# EasyEDA schematic SCH_Flight-Computer-V5_2024-08-06.json

## Sheets
1 Components: TITLE: Components; REV: 1.0; Date: 2024-08-05; Sheet: 1/1; Drawn By: usedgenes; Company: Company
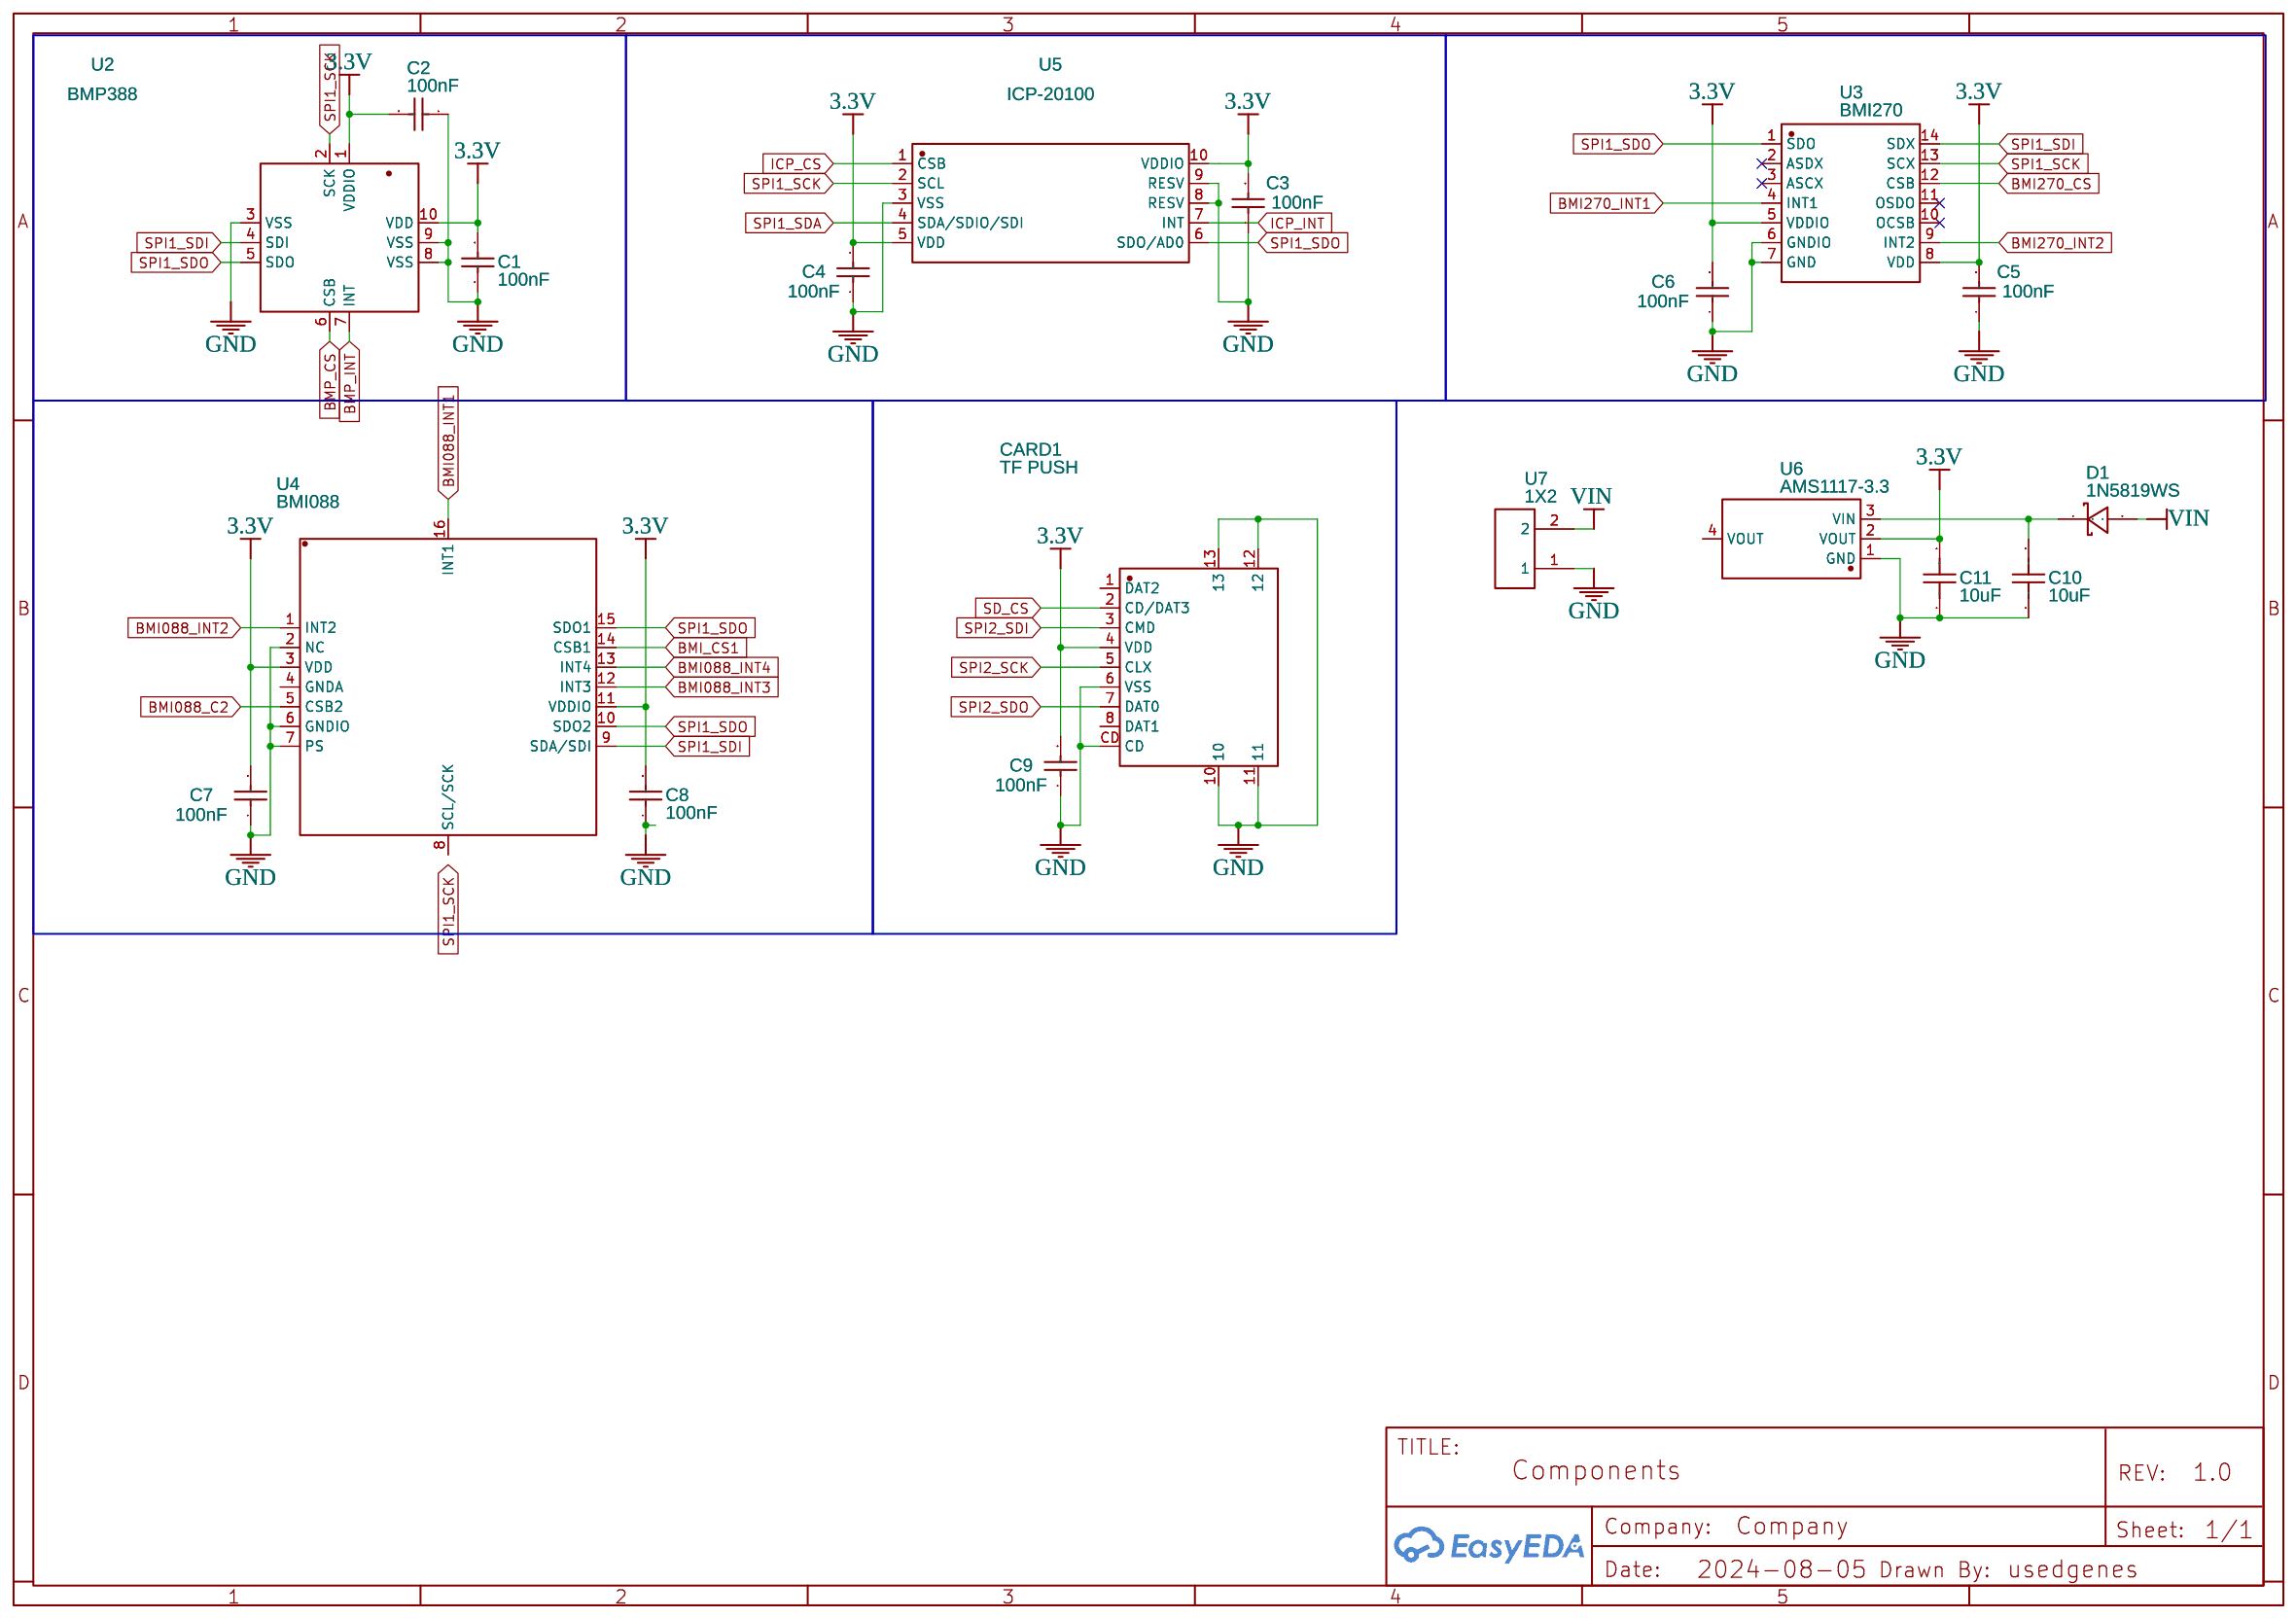
[diagram p0: Components]
2 STM: TITLE: STM Components; Company: Your Company
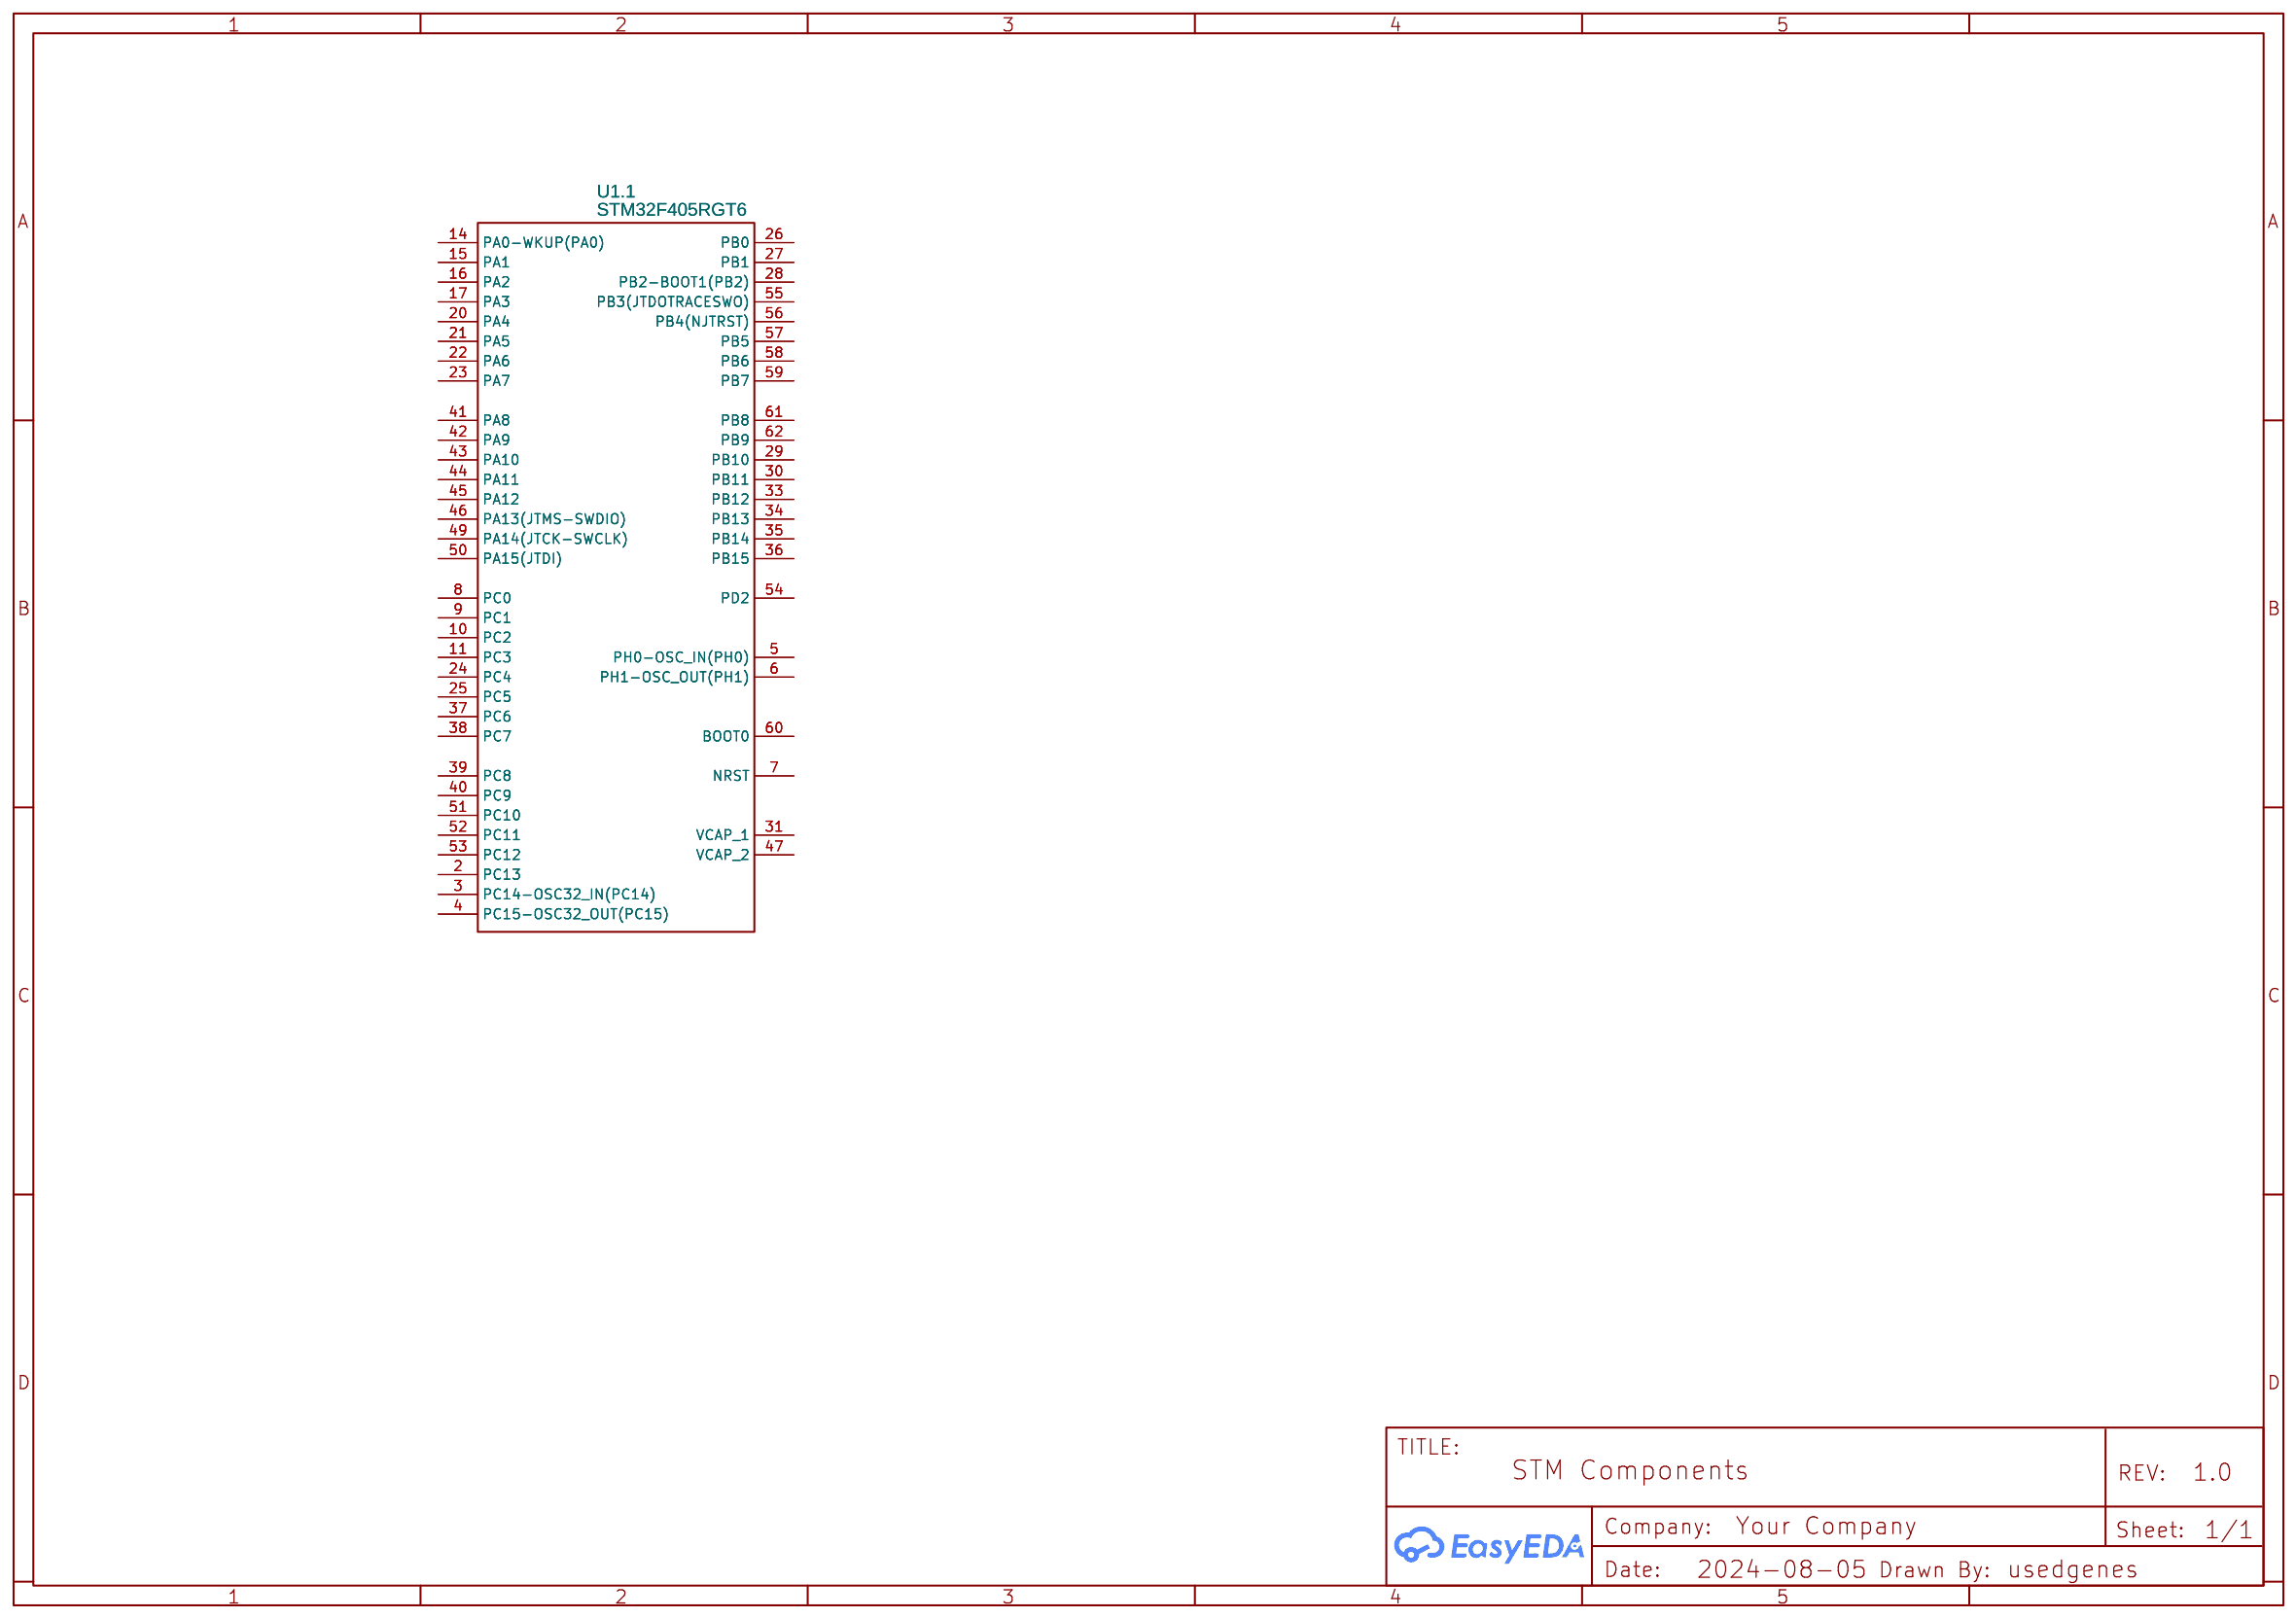
[diagram p1: STM]

## Parts
sheet Components
C1  100nF  [C0402]
C2  100nF  [C0402]
C3  100nF  [C0402]
C4  100nF  [C0402]
C5  100nF  [C0402]
C6  100nF  [C0402]
C7  100nF  [C0402]
C8  100nF  [C0402]
C9  100nF  [C0402]
C10  10uF  [C0603]
C11  10uF  [C0603]
CARD1  TF PUSH  [TF-SMD_TF-PUSH]
D1  1N5819WS  [SOD-323_L1.8-W1.3-LS2.5-RD]
U2  BMP388  [SENSORM-SMD_BMP388]
U3  BMI270  [LGA-14_L3.0-W2.5-P0.50-BR]
U4  BMI088  [LGA-16_L4.5-W3.0-P0.50-BL]
U5  ICP-20100  [LGA-10_L2.0-W2.0-P0.50-TL_ICP-20100]
U6  AMS1117-3.3  [SOT-223-3_L6.5-W3.4-P2.30-LS7.0-BR]
U7  1X2  [PIN HEADER CONNECTOR 1X2 PINS_PITCH 2.54MM]
sheet STM
U1  STM32F405RGT6  [LQFP-64_L10.0-W10.0-P0.50-LS12.0-BL]  (section 1)

## Library data of the parts
C1-C9 = CL05B104KO5NNNC: Supplier: LCSC; Manufacturer: SAMSUNG(三星); Supplier Part: C1525; JLCPCB Part Class: Basic Part
C10 C11 = CL10A106KP8NNNC: Supplier: LCSC; Manufacturer: SAMSUNG(三星); Supplier Part: C19702; JLCPCB Part Class: Basic Part
CARD1 = TF PUSH: Contributor: LCSC; Supplier: LCSC; Supplier Part: C393941; Manufacturer: SHOU HAN(首韩); JLCPCB Part Class: Extended Part
D1 = 1N5819WS: Contributor: LCSC; Supplier: LCSC; Supplier Part: C191023; Manufacturer: Hottech(合科泰); JLCPCB Part Class: Basic Part
U2 = BMP388: Contributor: LCSC; Supplier: LCSC; Supplier Part: C779278; Manufacturer: Bosch(博世); JLCPCB Part Class: Extended Part
U3 = BMI270: Contributor: LCSC; Supplier: LCSC; Supplier Part: C2836813; Manufacturer: Bosch(博世); JLCPCB Part Class: Extended Part
U4 = BMI088: Contributor: LCSC; Supplier: LCSC; Supplier Part: C194919; Manufacturer: Bosch(博世); JLCPCB Part Class: Extended Part
U5 = ICP-20100: Supplier: LCSC; Supplier Part: C5343527; Manufacturer: TDK; JLCPCB Part Class: Extended Part; Contributor: lcsc
U6 = AMS1117-3.3: sourceId: dwIGgezVh; Supplier: LCSC; Manufacturer: AMS; Supplier Part: C6186; JLCPCB Part Class: Basic Part
U7 = 1X2: Contributor: suriya.chun
U1 = STM32F405RGT6: tags: STM32; subpart_no: 1; image: http://image.lceda.cn/szlcsc/C15742.jpg; Supplier Part: C15742; Supplier: LCSC; Manufacturer: ST(意法半导体); JLCPCB Part Class: Extended Part

## Nets
3.3V: C1.2 C2.2 C3.2 C4.2 C5.2 C6.2 C7.2 C8.2 C9.2 C11.2 CARD1.4(VDD) U2.1(VDDIO) U2.10(VDD) U3.5(VDDIO) U3.8(VDD) U4.3(VDD) U4.11(VDDIO) U5.5(VDD) U5.10(VDDIO) U6.2(VOUT)
GND: C1.1 C2.1 C3.1 C4.1 C5.1 C6.1 C7.1 C8.1 C9.1 C10.1 C11.1 CARD1.6(VSS) CARD1.10 CARD1.11 CARD1.12 CARD1.13 CARD1.CD U2.3(VSS) U2.8(VSS) U2.9(VSS) U3.6(GNDIO) U3.7(GND) U4.2(NC) U4.6(GNDIO) U4.7(PS) U5.3(VSS) U5.8(RESV) U5.9(RESV) U6.1(GND) U7.1
VIN: D1.2(A) U7.2
BMI088_C2: U4.5(CSB2)
BMI088_INT1: U4.16(INT1)
BMI088_INT2: U4.1(INT2)
BMI088_INT3: U4.12(INT3)
BMI088_INT4: U4.13(INT4)
BMI270_CS: U3.12(CSB)
BMI270_INT1: U3.4(INT1)
BMI270_INT2: U3.9(INT2)
BMI_CS1: U4.14(CSB1)
BMP_CS: U2.6(CSB)
BMP_INT: U2.7(INT)
ICP_CS: U5.1(CSB)
ICP_INT: U5.7(INT)
SD_CS: CARD1.2(CD/DAT3)
SPI1_SCK: U2.2(SCK) U3.13(SCX) U5.2(SCL)
SPI1_SDA: U5.4(SDA/SDIO/SDI)
SPI1_SDI: U2.4(SDI) U3.14(SDX) U4.9(SDA/SDI)
SPI1_SDO: U2.5(SDO) U3.1(SDO) U4.10(SDO2) U4.15(SDO1) U5.6(SDO/AD0)
SPI2_SCK: CARD1.5(CLX)
SPI2_SDI: CARD1.3(CMD)
SPI2_SDO: CARD1.7(DAT0)
Net-(C10-2): C10.2 D1.1(K) U6.3(VIN)

Not connected (* = marked no-connect by the designer): CARD1 1(DAT2) 8(DAT1); U1 2(PC13) 3(PC14-OSC32_IN(PC14)) 4(PC15-OSC32_OUT(PC15)) 5(PH0-OSC_IN(PH0)) 6(PH1-OSC_OUT(PH1)) 7(NRST) 8(PC0) 9(PC1) 10(PC2) 11(PC3) 14(PA0-WKUP(PA0)) 15(PA1) 16(PA2) 17(PA3) 20(PA4) 21(PA5) 22(PA6) 23(PA7) 24(PC4) 25(PC5) 26(PB0) 27(PB1) 28(PB2-BOOT1(PB2)) 29(PB10) 30(PB11) 31(VCAP_1) 33(PB12) 34(PB13) 35(PB14) 36(PB15) 37(PC6) 38(PC7) 39(PC8) 40(PC9) 41(PA8) 42(PA9) 43(PA10) 44(PA11) 45(PA12) 46(PA13(JTMS-SWDIO)) 47(VCAP_2) 49(PA14(JTCK-SWCLK)) 50(PA15(JTDI)) 51(PC10) 52(PC11) 53(PC12) 54(PD2) 55(PB3(JTDOTRACESWO)) 56(PB4(NJTRST)) 57(PB5) 58(PB6) 59(PB7) 60(BOOT0) 61(PB8) 62(PB9); U3 2(ASDX)* 3(ASCX)* 10(OCSB)* 11(OSDO)*; U4 4(GNDA) 8(SCL/SCK); U6 4(VOUT)
